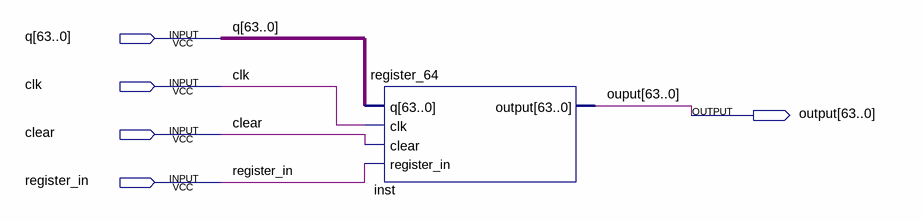
[diagram p0: schematic sheet]
// Quartus schematic register_64.bdf as structural Verilog: 1 symbols, 5 pins
module register_64 (
  input  [63:0] q,
  input  clk,
  input  clear,
  input  register_in,
  output [63:0] \output 
);

  register_64 inst (.q(q), .clk(clk), .clear(clear), .register_in(register_in), .\output (\output ));

  // Other names for the same wires on the sheet: ouput[63:0] = \output 
endmodule
